# EAGLE design Co-Processor-v1 (EAGLE 7.6.0)
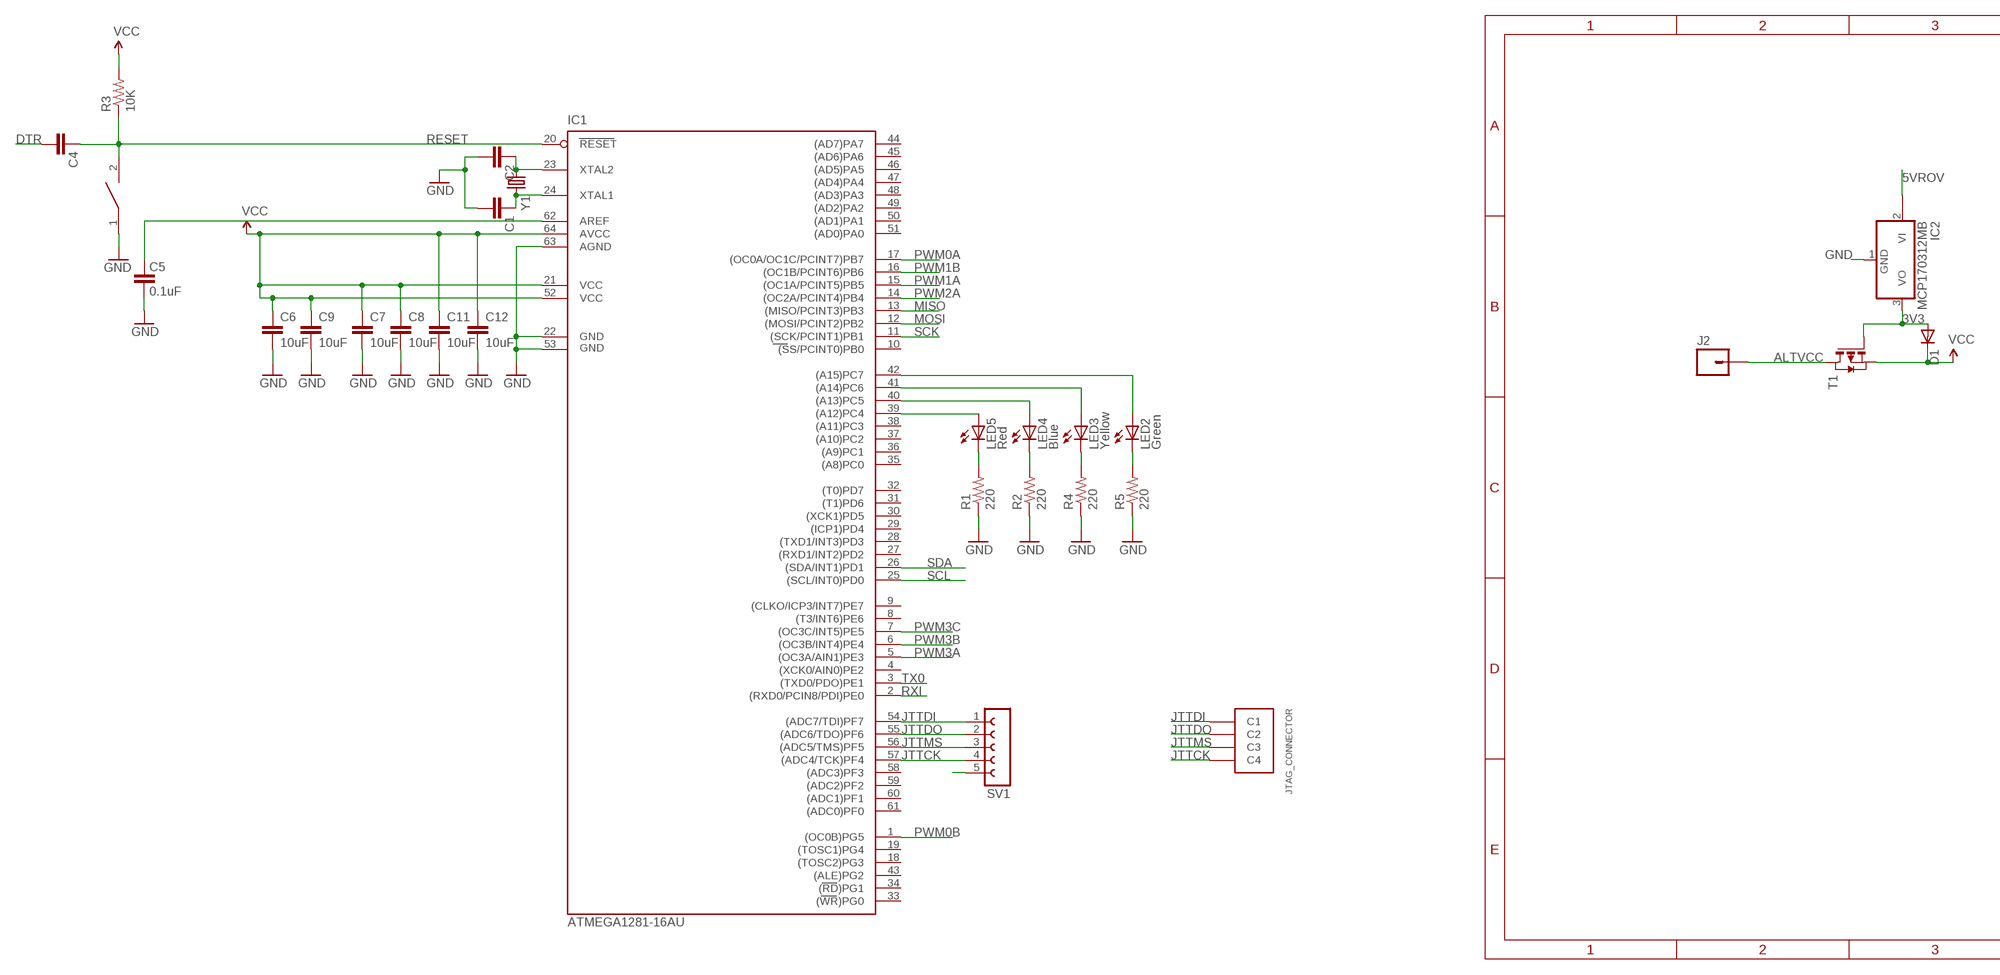
[diagram p0: schematic, sheet 1, part 1 of 2]
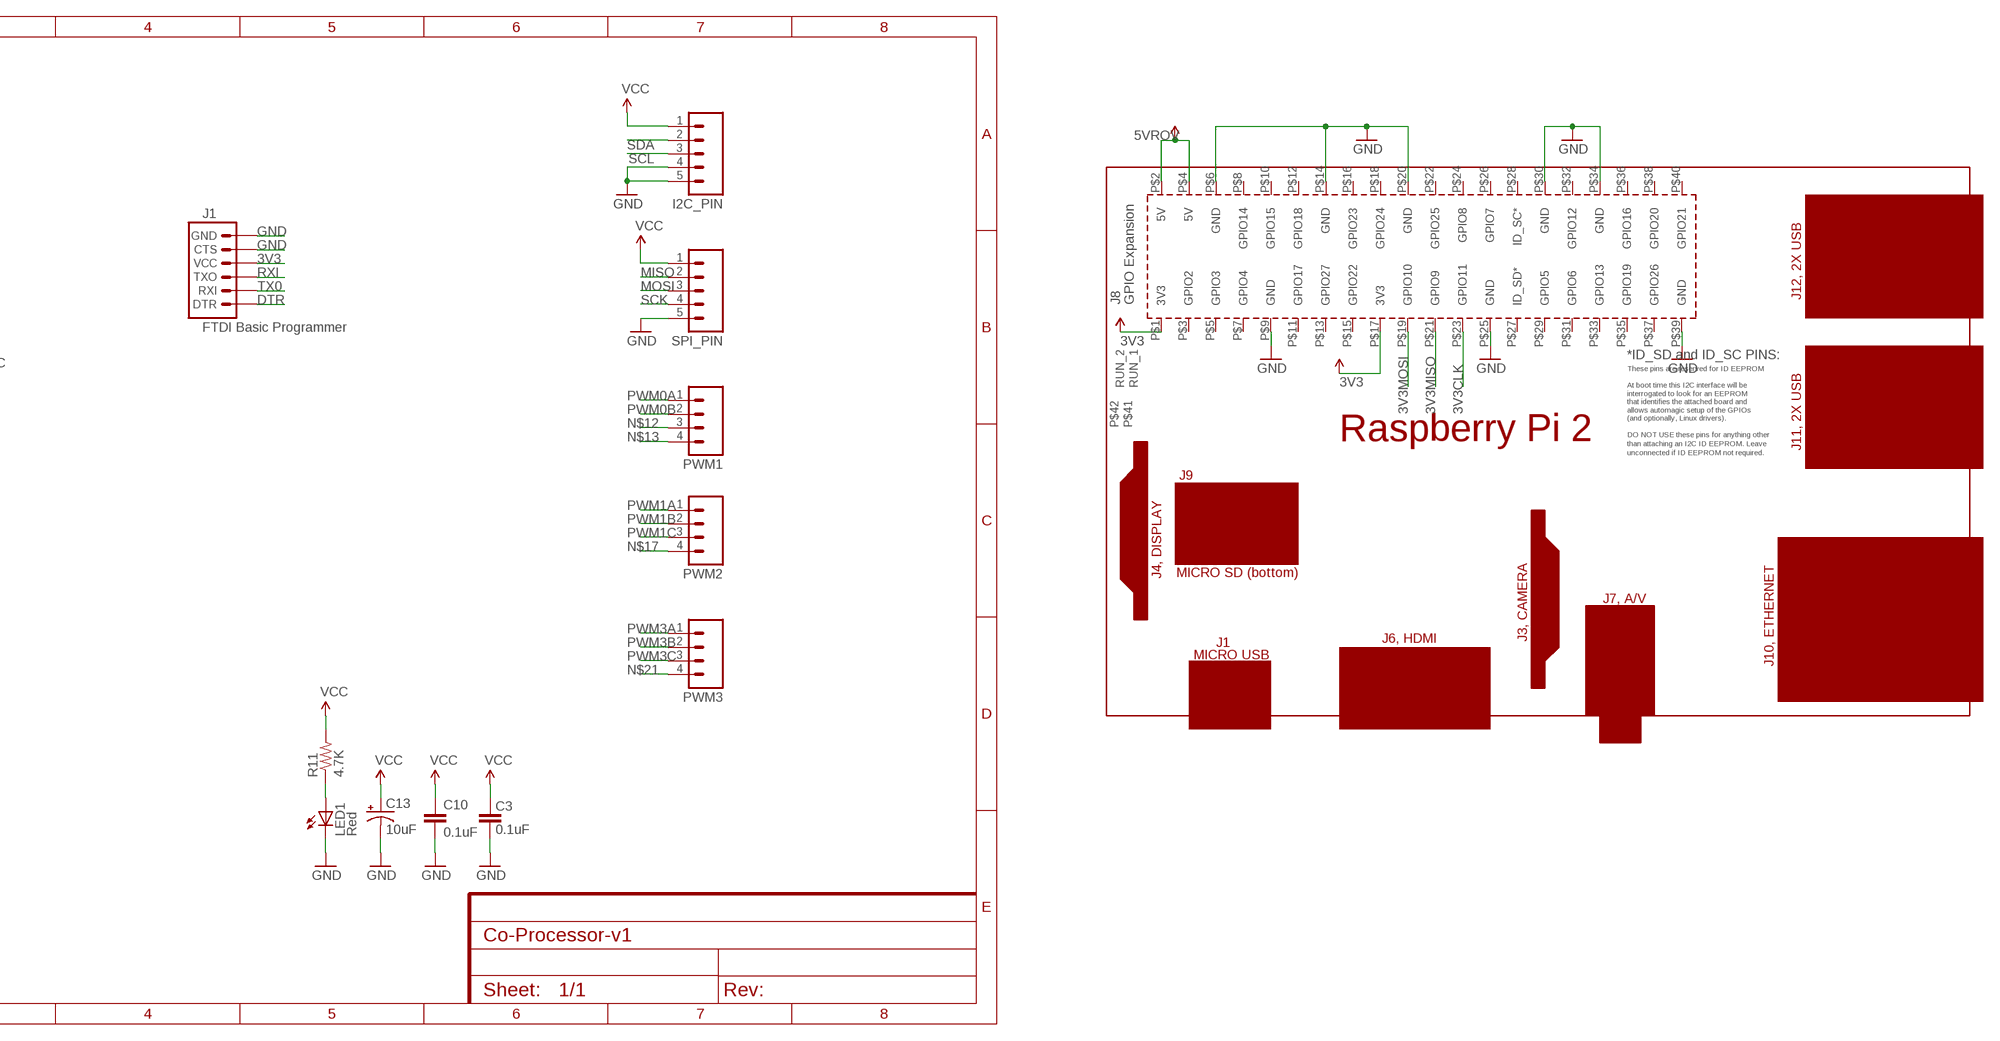
[diagram p1: schematic, sheet 1, part 2 of 2]

## Parts
C1  CAP0603-CAP  [0603-CAP]
C2  CAP0603-CAP  [0603-CAP]
C3  0.1uF  CAP0402-CAP  [0402-CAP]
C4  CAP0603-CAP  [0603-CAP]
C5  0.1uF  CAP0402-CAP  [0402-CAP]
C6  10uF  CAP0603-CAP  [0603-CAP]
C7  10uF  CAP0603-CAP  [0603-CAP]
C8  10uF  CAP0603-CAP  [0603-CAP]
C9  10uF  CAP0603-CAP  [0603-CAP]
C10  0.1uF  CAP0402-CAP  [0402-CAP]
C11  10uF  CAP0603-CAP  [0603-CAP]
C12  10uF  CAP0603-CAP  [0603-CAP]
C13  10uF  CAP_POL1206  [EIA3216]
D1  DIODE-DO-214AC  [DO-214AC]
I2C_PIN  M05PTH  [1X05]
IC1  ATMEGA1281-16AU  [TQFP64]
IC2  MCP170312MB  [SOT89]
J1  FTDI Basic Programmer  ARDUINO_SERIAL_PROGRAMPTH  [1X06]
J2  M01PTH  [1X01]
JTAG_CONNECTOR  MICRO-FIT-4-SMD-PART  [MICRO-FIT-4-SMD]
LED1  Red  LED0603  [LED-0603]
LED2  Green  LED0603  [LED-0603]
LED3  Yellow  LED0603  [LED-0603]
LED4  Blue  LED0603  [LED-0603]
LED5  Red  LED0603  [LED-0603]
PCB1  RPI2  [RPI2]
PWM1  M04PTH  [1X04]
PWM2  M04PTH  [1X04]
PWM3  M04PTH  [1X04]
R1  220  RESISTOR0402-RES  [0402-RES]
R2  220  RESISTOR0402-RES  [0402-RES]
R3  10K  RESISTOR0603-RES  [0603-RES]
R4  220  RESISTOR0402-RES  [0402-RES]
R5  220  RESISTOR0402-RES  [0402-RES]
R11  4.7K  RESISTOR0402-RES  [0402-RES]
SPI_PIN  M05PTH  [1X05]
SV1  FE05-1  [FE05-1]
T1  FDN340P  [SOT-23]
U$1  SWITCH  [SW_2512]
Y1  CRYSTALHC49US  [HC49US]

## Nets
3V3: D1.A IC2.3(VO) J1.4(VCC) PCB1.P$1(3V3) PCB1.P$17(3V3) T1.3(G) ; supply symbol labelled VCCA
3V3CLK: PCB1.P$23(GPIO11)
3V3MISO: PCB1.P$21(GPIO9)
3V3MOSI: PCB1.P$19(GPIO10)
5VROV: IC2.2@1(VI1) PCB1.P$2(5V) PCB1.P$4(5V) ; supply symbol labelled VCCA
ALTVCC: J2.1 T1.1(D)
DTR: C4.2 J1.1(DTR)
GND [vcc]: C1.2 C2.2 C3.1 C5.1 C6.2 C7.2 C8.2 C9.2 C10.2 C11.2 C12.2 C13.C(-) I2C_PIN.4 I2C_PIN.5 IC1.22(GND) IC1.53(GND1) IC1.63(AGND) IC2.1(GND) J1.5(CTS) J1.6(GND) LED1.C PCB1.P$6(GND) PCB1.P$9(GND) PCB1.P$14(GND) PCB1.P$20(GND) PCB1.P$25(GND) PCB1.P$30(GND) PCB1.P$34(GND) PCB1.P$39(GND) R1.1 R2.1 R4.1 R5.1 SPI_PIN.5 SV1.5 U$1.1
JTTCK: IC1.57((ADC4/TCK)PF4) JTAG_CONNECTOR.C4 SV1.4
JTTDI: IC1.54((ADC7/TDI)PF7) JTAG_CONNECTOR.C1 SV1.1
JTTDO: IC1.55((ADC6/TDO)PF6) JTAG_CONNECTOR.C2 SV1.2
JTTMS: IC1.56((ADC5/TMS)PF5) JTAG_CONNECTOR.C3 SV1.3
MISO: IC1.13((MISO/PCINT3)PB3) SPI_PIN.2
MOSI: IC1.12((MOSI/PCINT2)PB2) SPI_PIN.3
N$1: C1.1 IC1.24(XTAL1) Y1.2
N$3: C2.1 IC1.23(XTAL2) Y1.1
N$5: IC1.39((A12)PC4) LED5.A
N$7: C5.2 IC1.62(AREF)
N$9: IC1.40((A13)PC5) LED4.A
N$10: IC1.41((A14)PC6) LED3.A
N$11: IC1.42((A15)PC7) LED2.A
N$12: PWM1.3
N$13: PWM1.4
N$14: LED5.C R1.2
N$15: LED4.C R2.2
N$16: LED3.C R4.2
N$17: PWM2.4
N$21: PWM3.4
N$22: LED2.C R5.2
N$38: LED1.A R11.1
PWM0A: IC1.17((OC0A/OC1C/PCINT7)PB7) PWM1.1
PWM0B: IC1.1((OC0B)PG5) PWM1.2
PWM1A: IC1.15((OC1A/PCINT5)PB5) PWM2.1
PWM1B: IC1.16((OC1B/PCINT6)PB6) PWM2.2
PWM1C: PWM2.3
PWM2A: IC1.14((OC2A/PCINT4)PB4)
PWM3A: IC1.5((OC3A/AIN1)PE3) PWM3.1
PWM3B: IC1.6((OC3B/INT4)PE4) PWM3.2
PWM3C: IC1.7((OC3C/INT5)PE5) PWM3.3
RESET: C4.1 IC1.20(RESET) R3.1 U$1.2
RXI: IC1.2((RXD0/PCIN8/PDI)PE0) J1.3(TXO)
SCK: IC1.11((SCK/PCINT1)PB1) SPI_PIN.4
SCL: I2C_PIN.3 IC1.25((SCL/INT0)PD0)
SDA: I2C_PIN.2 IC1.26((SDA/INT1)PD1)
TX0: IC1.3((TXD0/PDO)PE1) J1.2(RXI)
VCC: C3.2 C6.1 C7.1 C8.1 C9.1 C10.1 C11.1 C12.1 C13.A(+) D1.C I2C_PIN.1 IC1.21(VCC) IC1.52(VCC1) IC1.64(AVCC) R3.2 R11.2 SPI_PIN.1 T1.2(S)
Unconnected: IC1.4((XCK0/AIN0)PE2) IC1.8((T3/INT6)PE6) IC1.9((CLKO/ICP3/INT7)PE7) IC1.10((SS/PCINT0)PB0) IC1.18((TOSC2)PG3) IC1.19((TOSC1)PG4) IC1.27((RXD1/INT2)PD2) IC1.28((TXD1/INT3)PD3) IC1.29((ICP1)PD4) IC1.30((XCK1)PD5) IC1.31((T1)PD6) IC1.32((T0)PD7) IC1.33((WR)PG0) IC1.34((RD)PG1) IC1.35((A8)PC0) IC1.36((A9)PC1) IC1.37((A10)PC2) IC1.38((A11)PC3) IC1.43((ALE)PG2) IC1.44((AD7)PA7) IC1.45((AD6)PA6) IC1.46((AD5)PA5) IC1.47((AD4)PA4) IC1.48((AD3)PA3) IC1.49((AD2)PA2) IC1.50((AD1)PA1) IC1.51((AD0)PA0) IC1.58((ADC3)PF3) IC1.59((ADC2)PF2) IC1.60((ADC1)PF1) IC1.61((ADC0)PF0) IC2.2(VI) PCB1.P$3(GPIO2) PCB1.P$5(GPIO3) PCB1.P$7(GPIO4) PCB1.P$8(GPIO14) PCB1.P$10(GPIO15) PCB1.P$11(GPIO17) PCB1.P$12(GPIO18) PCB1.P$13(GPIO27) PCB1.P$15(GPIO22) PCB1.P$16(GPIO23) PCB1.P$18(GPIO24) PCB1.P$22(GPIO25) PCB1.P$24(GPIO8) PCB1.P$26(GPIO7) PCB1.P$27(ID_SD*) PCB1.P$28(ID_SC*) PCB1.P$29(GPIO5) PCB1.P$31(GPIO6) PCB1.P$32(GPIO12) PCB1.P$33(GPIO13) PCB1.P$35(GPIO19) PCB1.P$36(GPIO16) PCB1.P$37(GPIO26) PCB1.P$38(GPIO20) PCB1.P$40(GPIO21) PCB1.P$41(RUN_1) PCB1.P$42(RUN_2)

## Library data of the parts
C1 C2 C4 = SparkFun-Capacitors:CAP: Capacitor Standard 0603 ceramic capacitor, and 0.1" leaded capacitor.
C3 C5 C10 = SparkFun:CAP: Capacitor Standard 0603 ceramic capacitor, and 0.1" leaded capacitor.
C6-C9 C11 C12 = SparkFun-Passives:CAP: Capacitor Standard 0603 ceramic capacitor, and 0.1" leaded capacitor.
C13 = SparkFun:CAP_POL: Capacitor Polarized These are standard SMD and PTH capacitors. Normally 10uF, 47uF, and 100uF in electrolytic and tantalum varieties. Always verify the external diameter of the through hole cap, it varies with capacity, voltage, and manufacturer. The EIA devices should be standard.
D1 = DiscreteComponents:DIODE-: DIODE
I2C_PIN SPI_PIN = SparkFun-Connectors:M05: Header 5 Standard 5-pin 0.1" header. Use with straight break away headers (SKU : PRT-00116), right angle break away headers (PRT-00553), swiss pins (PRT-00743), machine pins (PRT-00117), and female headers (PRT-00115). Molex polarized connector foot print use with SKU : PRT-08230 with associated crimp pins and housings.
IC1 = atmel-2005:ATMEGA1281*: MICROCONTROLLER 128 Kbytes FLASH 4 Kbytes EEPROM 8 Kbytes SRAM 54 General Purpose I/O pins 6-channels 16-bit PWM 2 x Serial USARTs 8-channels 10-bit A/D
IC2 = linear:MCP1703*: 250 mA, 16V, Low Quiescent Current LDO Regulator Source: http://ww1.microchip.com/downloads/en/DeviceDoc/22049b.pdf
J1 = SparkFun-Connectors:ARDUINO_SERIAL_PROGRAM: FTDI connector footprints
J2 = SparkFun-Connectors:M01: Header 1 Standard 1-pin 0.1" header. Use with straight break away headers (SKU : PRT-00116), right angle break away headers (PRT-00553), swiss pins (PRT-00743), machine pins (PRT-00117), and female headers (PRT-00115). SMTSO-256-ET is a "flush mount" nut for a 4-40 screw. The older package used to be too tight, and did not allow it to sit properly thru the drill hit. The latest (0.165DIA) fits nice and snug.
JTAG_CONNECTOR = Connectors:MICRO-FIT-4-SMD: 4 Pin Molex connector; DIGIKEY-CONTACT-PN: WM1125CT-ND; DIGIKEY-FEMALE-PN: WM2640CT-ND; DIGIKEY-MALE-PN: WM1847-ND
LED1-LED5 = SparkFun:LED: LEDs Standard schematic elements and footprints for 5mm, 3mm, 1206, and 0603 sized LEDs. 5mm - Spark Fun Electronics SKU : COM-00529 (and others)
PCB1 = e14_Rpi2_RevA:RPI2: Device for Raspberry Pi 2 board created by www.element14.com More information and support community is available at http://www.element14.com/community/community/raspberry-pi/raspberrypi2
PWM1-PWM3 = SparkFun-Connectors:M04: Header 4 Standard 4-pin 0.1" header. Use with straight break away headers (SKU : PRT-00116), right angle break away headers (PRT-00553), swiss pins (PRT-00743), machine pins (PRT-00117), and female headers (PRT-00115). Molex polarized connector foot print use with SKU : PRT-08231 with associated crimp pins and housings. 1MM SMD Version SKU: PRT-10208; PROD_ID: CONN-09696
R1 R2 R4 R5 R11 = SparkFun:RESISTOR: Resistor Basic schematic elements and footprints for 0603, 1206, and PTH resistors.
R3 = SparkFun-Passives:RESISTOR: Resistor Basic schematic elements and footprints for 0603, 1206, and PTH resistors.
SV1 = con-lsta:FE05-1: FEMALE HEADER; OC_FARNELL: unknown; OC_NEWARK: unknown
T1 = DiscreteComponents:FDN340P: MOS FET; DIGIKEY: FDN340PCT-ND
U$1 = DiscreteComponents:SWITCH
Y1 = SparkFun-FreqCtrl:CRYSTAL: Various standard crystals. Proven footprints.

## Net classes
0 default: width 0.203 mm
1 vcc: width 0.254 mm

## Board
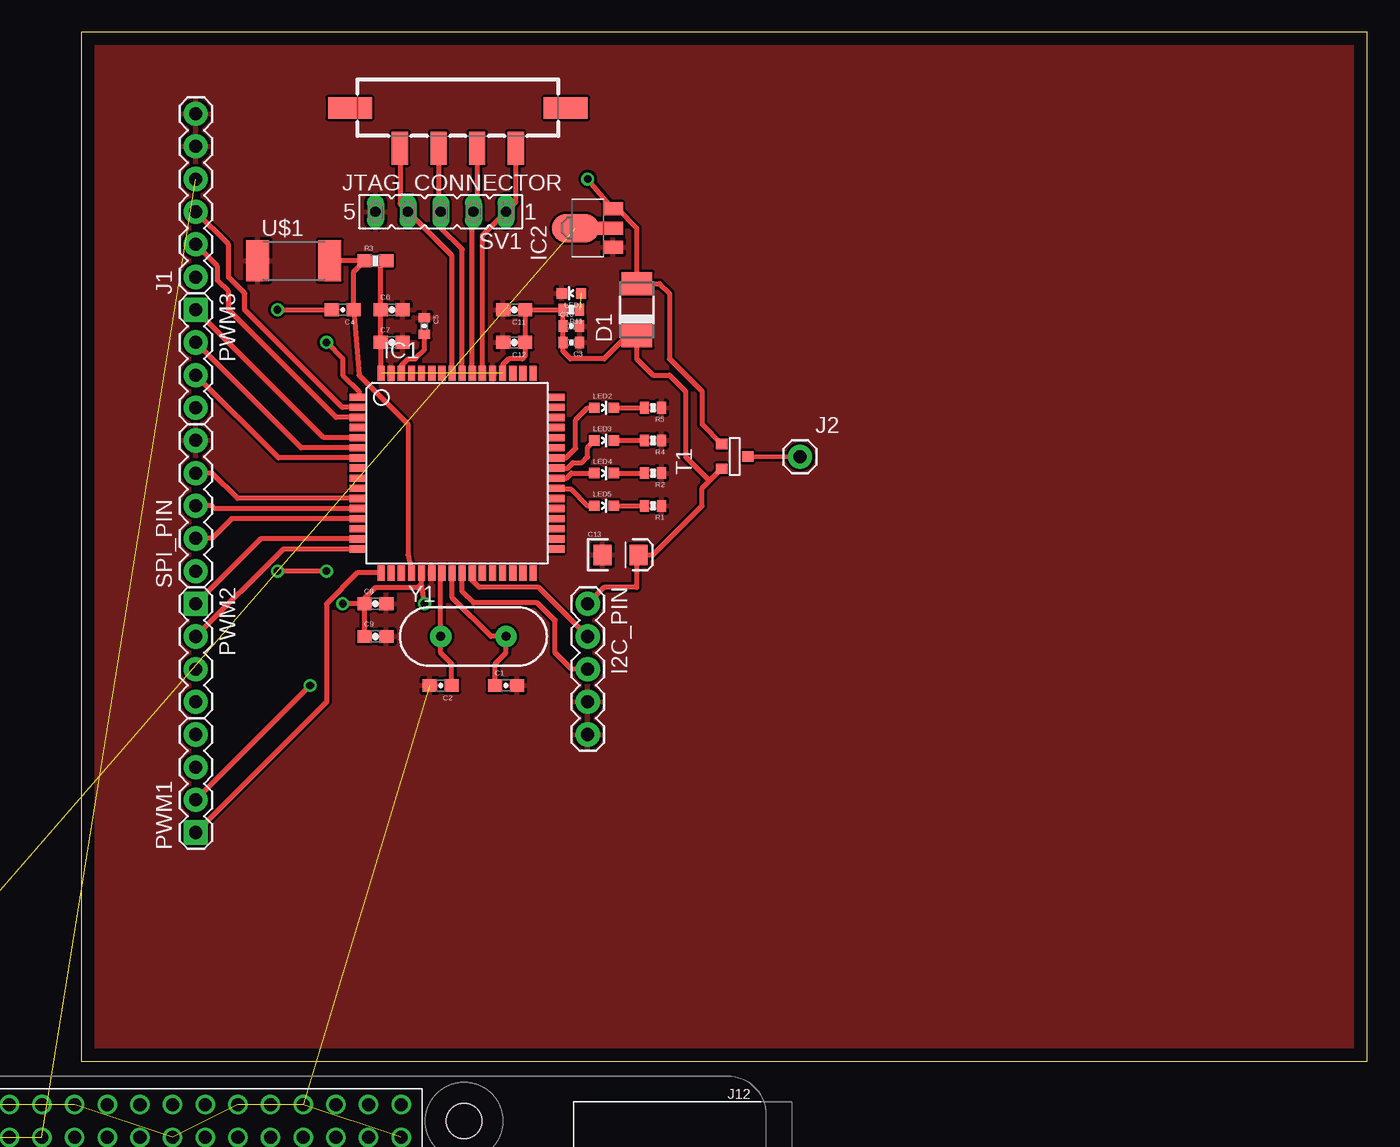
[diagram p2: board, top side]
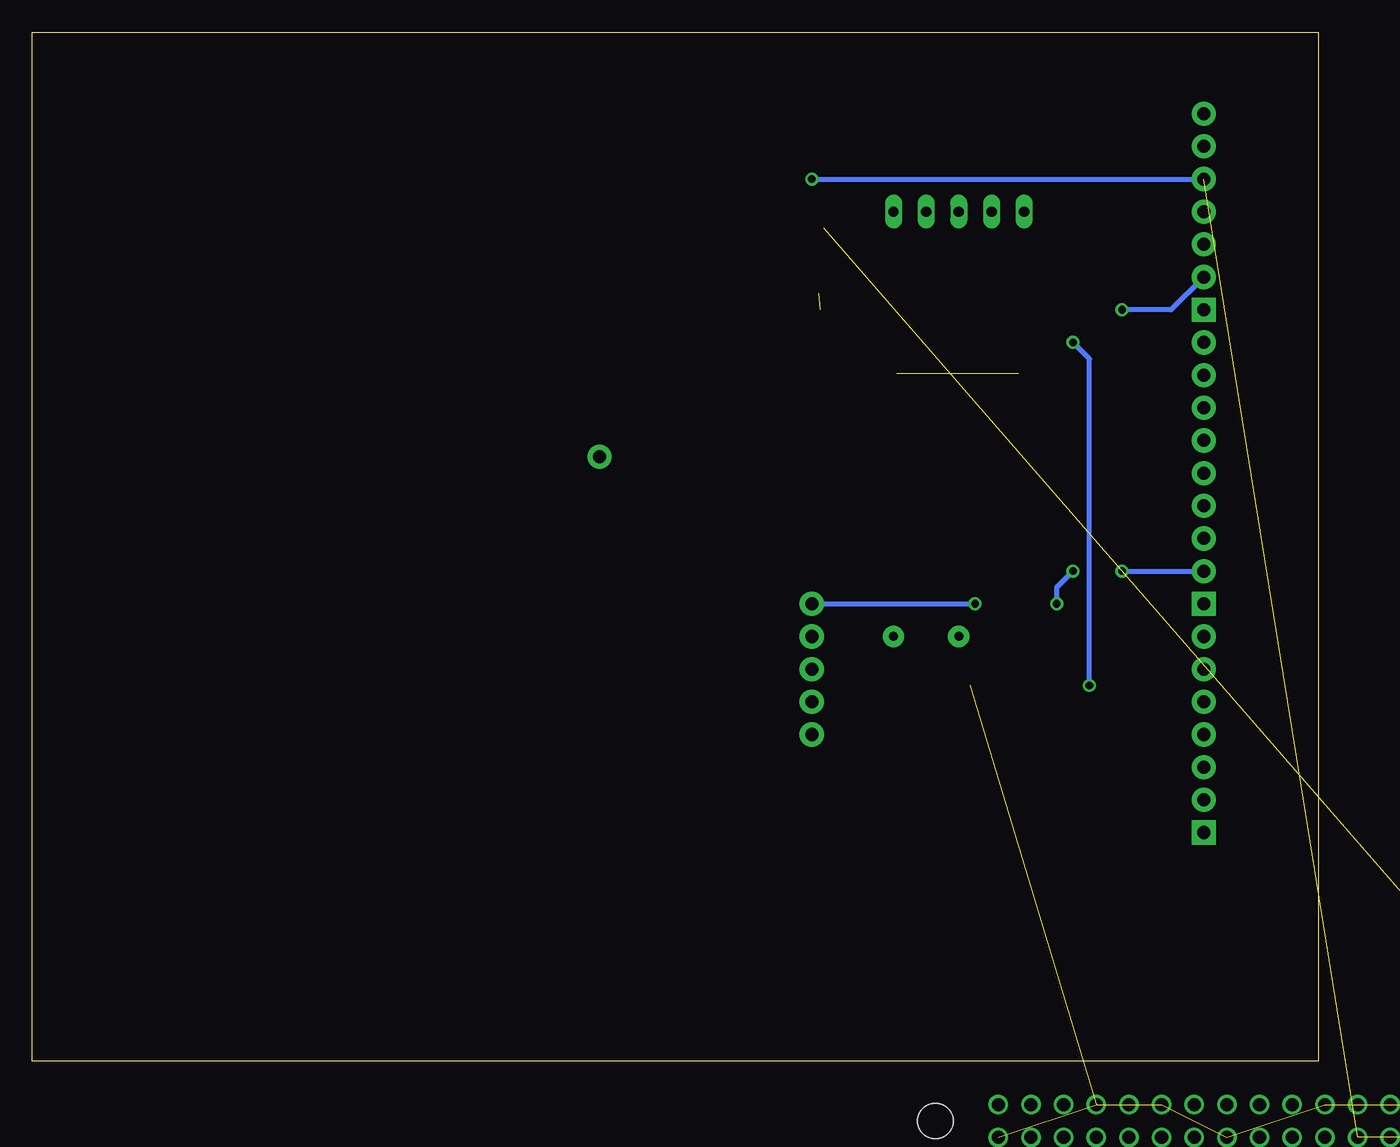
[diagram p3: board, bottom side, seen from below]

Size 100 x 80 mm. Coordinates in mm from the lower left corner, seen from the top.
Outline: 0,0 100,0 100,80 0,80 0,0
Copper layers (1*16): Top 0.035mm / dielectric 1.5mm / Bottom 0.035mm
Design rules "default": minimum track width 10mil, minimum drill 24mil, track to track 8mil, track to pad 8mil, pad to pad 8mil, via to via 8mil, smd to smd 8mil, copper to edge 40mil, drill to drill 8mil, minimum pad ring 10mil, minimum via ring 8mil, stop-mask expansion 4mil, vias tented up to drill 0mil, thermal gap 10mil

### Footprints (pad centres in the part's own frame; a part is rotated, then mirrored left to right if it is on the bottom)
0603-CAP = smd 1.1 x 1: 1 -0.85,0; 2 0.85,0
0402-CAP = smd 0.7 x 0.9: 1 -0.65,0; 2 0.65,0
EIA3216 = smd 1.4 x 1.6: A 1.4,0; C -1.4,0
DO-214AC = smd 1.8 x 2.4: A 2.025,0; C -2.025,0
1X05 = drill 1.016 pad 1.88: 1 0,0; 2 2.54,0; 3 5.08,0; 4 7.62,0; 5 10.16,0
TQFP64 = smd 1.194 x 0.559: 1 -7.76,5.905; 2 -7.76,5.118; 3 -7.76,4.331; 4 -7.76,3.543; 5 -7.76,2.756; 6 -7.76,1.968; 7 -7.76,1.181; 8 -7.76,0.394; 9 -7.76,-0.394; 10 -7.76,-1.181; 11 -7.76,-1.968; 12 -7.76,-2.756; 13 -7.76,-3.543; 14 -7.76,-4.331; 15 -7.76,-5.118; 16 -7.76,-5.905; 33 7.76,-5.905; 34 7.76,-5.118; 35 7.76,-4.331; 36 7.76,-3.543; 37 7.76,-2.756; 38 7.76,-1.968; 39 7.76,-1.181; 40 7.76,-0.394; 41 7.76,0.394; 42 7.76,1.181; 43 7.76,1.968; 44 7.76,2.756; 45 7.76,3.543; 46 7.76,4.331; 47 7.76,5.118; 48 7.76,5.905 | smd 0.559 x 1.194: 17 -5.905,-7.76; 18 -5.118,-7.76; 19 -4.331,-7.76; 20 -3.543,-7.76; 21 -2.756,-7.76; 22 -1.968,-7.76; 23 -1.181,-7.76; 24 -0.394,-7.76; 25 0.394,-7.76; 26 1.181,-7.76; 27 1.968,-7.76; 28 2.756,-7.76; 29 3.543,-7.76; 30 4.331,-7.76; 31 5.118,-7.76; 32 5.905,-7.76; 49 5.905,7.76; 50 5.118,7.76; 51 4.331,7.76; 52 3.543,7.76; 53 2.756,7.76; 54 1.968,7.76; 55 1.181,7.76; 56 0.394,7.76; 57 -0.394,7.76; 58 -1.181,7.76; 59 -1.968,7.76; 60 -2.756,7.76; 61 -3.543,7.76; 62 -4.331,7.76; 63 -5.118,7.76; 64 -5.905,7.76
SOT89 = smd 1 x 1.5: 1 -1.499,-1.981; 3 1.499,-1.981 | smd 1 x 2: 2 0,-1.727 | smd 2.2 x 3.7: 2@1 0,0.94
1X06 = drill 1.016 pad 1.88: 1 0,0; 2 2.54,0; 3 5.08,0; 4 7.62,0; 5 10.16,0; 6 12.7,0
1X01 = drill 1.016 pad 1.88: 1 0,0
MICRO-FIT-4-SMD = smd 1.27 x 2.54: C1 5.6,3.955; C2 8.6,3.955; C3 11.6,3.955; C4 14.6,3.955 | smd 3.43 x 1.65: NC1 1.715,0.825; NC2 18.485,0.825
LED-0603 = smd 0.8 x 0.8: A 0,-0.75; C 0,0.75
RPI2 = drill 1.016 square: P$1 8.37,51.23; P$41 4.8,41.2 | drill 1.016: P$2 8.357,53.772; P$3 10.897,51.232; P$4 10.897,53.772; P$5 13.437,51.232; P$6 13.437,53.772; P$7 15.977,51.232; P$8 15.977,53.772; P$9 18.517,51.232; P$10 18.517,53.772; P$11 21.057,51.232; P$12 21.057,53.772; P$13 23.597,51.232; P$14 23.597,53.772; P$15 26.137,51.232; P$16 26.137,53.772; P$17 28.677,51.232; P$18 28.677,53.772; P$19 31.217,51.232; P$20 31.217,53.772; P$21 33.757,51.232; P$22 33.757,53.772; P$23 36.297,51.232; P$24 36.297,53.772; P$25 38.837,51.232; P$26 38.837,53.772; P$27 41.377,51.232; P$28 41.377,53.772; P$29 43.917,51.232; P$30 43.917,53.772; P$31 46.457,51.232; P$32 46.457,53.772; P$33 48.997,51.232; P$34 48.997,53.772; P$35 51.537,51.232; P$36 51.537,53.772; P$37 54.077,51.232; P$38 54.077,53.772; P$39 56.617,51.232; P$40 56.617,53.772; P$42 2.26,41.2 | hole 2.75: 3.5,3.5; 61.5,3.5; 3.5,52.5; 61.5,52.5
1X04 = drill 1.016 pad 1.88 square: 1 0,0 | drill 1.016 pad 1.88: 2 2.54,0; 3 5.08,0; 4 7.62,0
0402-RES = smd 0.7 x 0.9: 1 -0.65,0; 2 0.65,0
0603-RES = smd 1.1 x 1: 1 -0.85,0; 2 0.85,0
FE05-1 = drill 0.813 long: 1 -5.08,0; 2 -2.54,0; 3 0,0; 4 2.54,0; 5 5.08,0
SOT-23 = smd 0.787 x 0.889: 1 0.025,-1.016; 2 -0.94,1.016; 3 0.991,1.016
SW_2512 = smd 1.8 x 3.2: 1 -2.8,0; 2 2.8,0
HC49US = drill 0.7 pad 1.651: 1 -2.54,0; 2 2.54,0

### Placement (x,y rotation side)
C1  33.02,29.21 0 top
C2  27.94,29.21 180 top
C3  38.1,55.88 180 top
C4  20.32,58.42 180 top
C5  26.67,57.15 270 top
C6  24.13,58.42 0 top
C7  24.13,55.88 0 top
C8  22.86,35.56 0 top
C9  22.86,33.02 0 top
C10  38.1,57.15 0 top
C11  33.66,58.42 180 top
C12  33.66,55.88 180 top
C13  41.91,39.37 0 top
D1  43.18,58.42 90 top
I2C_PIN  39.37,35.56 270 top
IC1  29.21,45.72 0 top
IC2  39.37,64.77 90 top
J1  8.89,60.96 90 top
J2  55.88,46.99 0 top
JTAG_CONNECTOR  39.37,74.93 180 top
LED1  38.1,59.69 90 top
LED2  40.64,50.8 270 top
LED3  40.64,48.26 270 top
LED4  40.64,45.72 270 top
LED5  40.64,43.18 270 top
PCB1  -31.75,-57.15 0 top  (outside the outline)
PWM1  8.89,17.78 90 top
PWM2  8.89,35.56 270 top
PWM3  8.89,58.42 270 top
R1  44.45,43.18 180 top
R2  44.45,45.72 180 top
R3  22.86,62.23 0 top
R4  44.45,48.26 180 top
R5  44.45,50.8 180 top
R11  38.1,58.42 180 top
SPI_PIN  8.89,38.1 90 top
SV1  27.94,66.04 180 top
T1  50.8,46.99 90 top
U$1  16.51,62.23 0 top
Y1  30.48,33.02 0 top

### Tracks (layer width: path | path; a pad name or v marks a point on that pad's centre or on a via)
3V3  (via drill 0.6)  (2 unrouted)
  Top 0.406: T1.3 48.26,49.51 48.26,52.07 45.72,54.61 45.72,59.69 44.97,60.45 D1.A 43.18,64.77 41.68,66.27 IC2.3 v39.37,68.58
  Bottom 0.406: v39.37,68.58 J1.4
5VROV  (2 unrouted)
ALTVCC
  Top 0.406: T1.1 J2.1
DTR  (via drill 0.6)
  Top 0.406: v15.24,58.42 C4.2
  Bottom 0.406: J1.1 11.43,58.42 v15.24,58.42
GND  (8 unrouted)
  pour Top: 0,80.01 100.33,80.01 100.33,0 0,0
JTTCK
  Top 0.406: JTAG_CONNECTOR.C4 24.77,66.67 SV1.4 28.82,62.62 IC1.57
JTTDI
  Top 0.406: JTAG_CONNECTOR.C1 33.77,66.79 SV1.1 31.18,64.2 IC1.54
JTTDO
  Top 0.406: JTAG_CONNECTOR.C2 30.77,66.33 SV1.2 30.39,65.95 IC1.55
JTTMS
  Top 0.406: JTAG_CONNECTOR.C3 27.77,66.21 SV1.3 27.94,64.77 29.6,63.11 IC1.56
MISO
  Top 0.406: IC1.13 11.7,42.18 10.16,40.64 SPI_PIN.2
MOSI
  Top 0.406: IC1.12 10.38,42.96 10.16,43.18 SPI_PIN.3
N$1
  Top 0.406: IC1.24 28.83,37.95 28.83,36.04 31.85,33.02 Y1.2 33.02,31.75 32.17,30.9 C1.1
N$3
  Top 0.406: IC1.23 27.94,37.87 Y1.1 27.94,31.75 28.79,30.9 C2.1
N$5
  Top 0.406: LED5.A 39.37,43.18 38.1,44.45 37.06,44.45 IC1.39
N$7
  Top 0.406: IC1.62 24.88,54.09 25.4,54.61 25.96,54.61 25.96,54.63 26.67,55.35 C5.2
N$9
  Top 0.406: IC1.40 37.71,45.33 38.1,45.72 LED4.A
N$10
  Top 0.406: IC1.41 37.81,46.11 38.23,46.53 38.91,46.53 39.37,46.99 39.37,47.74 LED3.A
N$11
  Top 0.406: IC1.42 37.68,46.9 38.43,47.65 38.43,49.86 39.37,50.8 LED2.A
N$14
  Top 0.406: LED5.C R1.2
N$15
  Top 0.406: LED4.C R2.2
N$16
  Top 0.406: LED3.C R4.2
N$22
  Top 0.406: LED2.C R5.2
N$38  (1 unrouted)
PWM0A
  Top 0.406: IC1.17 21.45,37.96 19.05,35.56 19.05,27.94 PWM1.1
PWM0B  (via drill 0.6)
  Top 0.406: PWM1.2 v17.78,29.21 | v19.05,55.88 20.32,54.61 20.32,53.34 21.59,52.07 21.59,51.77 IC1.1
  Bottom 0.406: v17.78,29.21 17.78,54.61 v19.05,55.88
PWM1A
  Top 0.406: IC1.15 13.93,40.6 PWM2.1
PWM1B
  Top 0.406: IC1.16 15.68,39.81 PWM2.2
PWM3A
  Top 0.406: IC1.5 18.83,48.48 PWM3.1
PWM3B
  Top 0.406: IC1.6 17.08,47.69 PWM3.2
PWM3C
  Top 0.406: IC1.7 15.33,46.9 PWM3.3
RESET
  Top 0.406: U$1.2 R3.1 21.17,61.39 C4.1 21.59,53.34 25.4,49.53 25.4,39.37 IC1.20
RXI
  Top 0.406: IC1.2 20.28,50.84 12.7,58.42 12.7,59.69 11.43,60.96 11.43,63.5 J1.3
SCK
  Top 0.406: IC1.11 12.13,43.75 10.16,45.72 SPI_PIN.4
SCL
  Top 0.406: I2C_PIN.3 38.1,30.48 36.83,31.75 36.83,34.29 36.78,34.29 35.43,35.64 30.48,35.64 29.62,36.5 29.62,37.95 IC1.25
SDA
  Top 0.406: I2C_PIN.2 35.56,36.83 30.94,36.83 30.35,37.41 30.35,37.92 IC1.26
TX0
  Top 0.406: IC1.3 19.8,50.05 11.43,58.42 11.43,59.84 10.59,60.68 10.59,61.8 J1.2
VCC  (via drill 0.6)  (1 unrouted)
  Top 0.406: I2C_PIN.1 40.64,36.83 43.18,36.83 43.18,39.37 C13.A 44.45,39.37 48.26,43.18 48.26,44.53 48.86,45.12 | 48.86,45.12 T1.2 | IC1.52 32.77,53.49 32.77,54.15 33.22,54.61 34.29,54.61 34.51,54.83 C12.1 C11.1 R11.2 C10.1 C3.2 37.44,55.19 38.02,54.61 40.64,54.61 42.42,56.4 D1.C 43.18,54.61 44.45,53.34 45.72,53.34 46.99,52.07 46.99,46.99 48.86,45.12 | IC1.64 23.28,53.5 C7.1 C6.1 23.28,61.8 R3.2 | C9.1 C8.1 | C8.1 22.01,35.98 22.86,36.83 26.16,36.83 26.44,37.11 | 26.44,37.11 26.44,37.95 IC1.21 | C8.1 v20.32,35.56 | v19.05,38.1 v15.24,38.1 | v26.67,35.56 26.44,37.11
  Bottom 0.406: v20.32,35.56 20.32,36.83 v19.05,38.1 | v15.24,38.1 SPI_PIN.1 | I2C_PIN.1 v26.67,35.56